# Altium schematic sheet MayRuaMach.SchDoc
size A
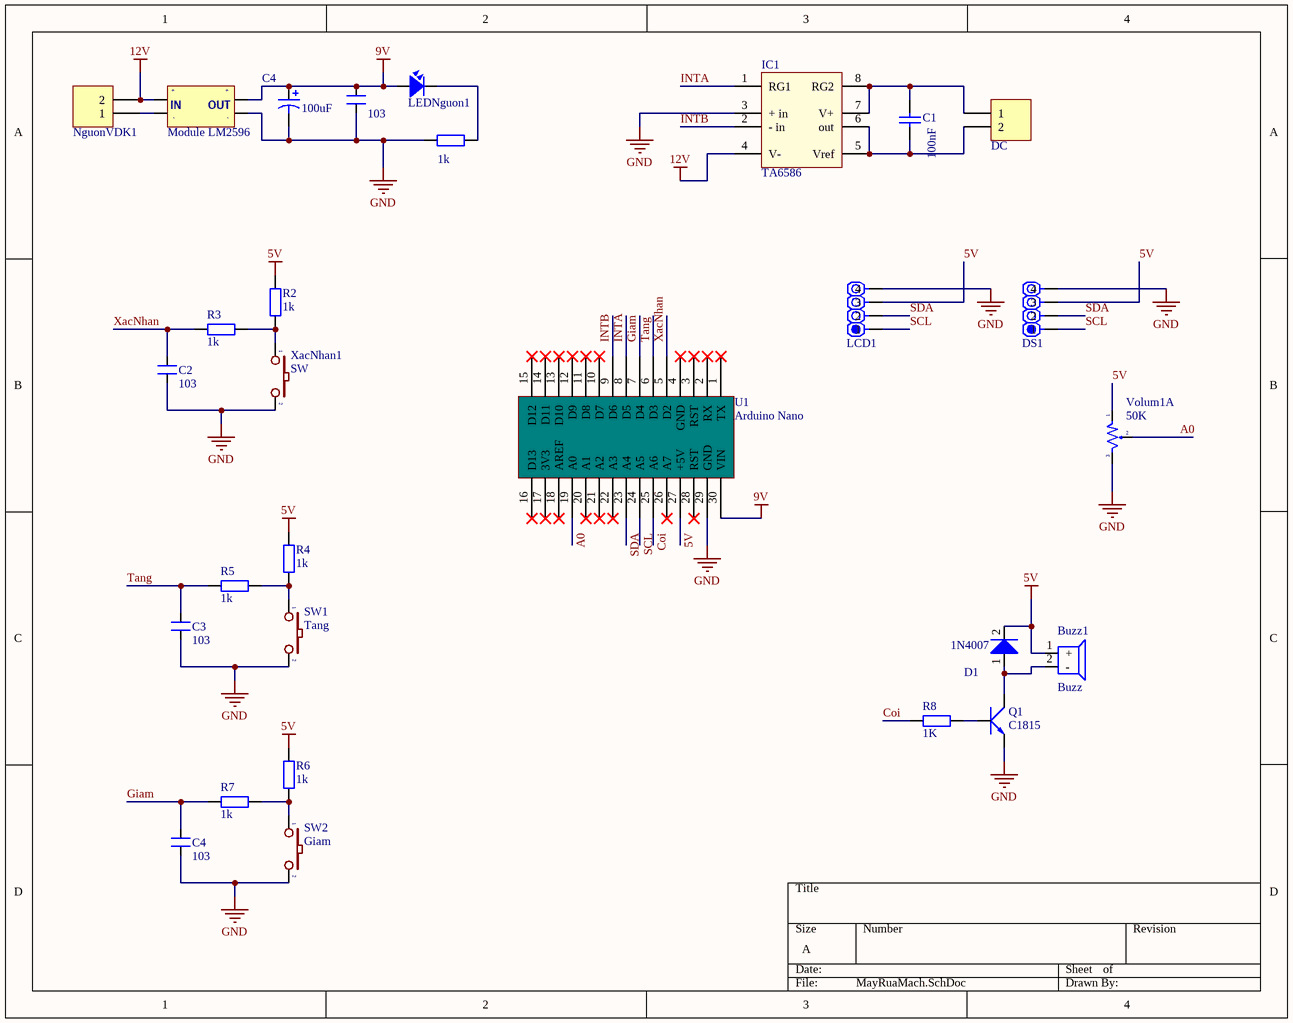
[diagram p0: MayRuaMach.SchDoc]

## Parts
Buzz1  Buzz  [Buzz]
C1  value 100nF  [CAPNTO2.54-3.05x1.78A]  (hidden comment: 5AK220KABAA)
C2  103  [CN1]
C3  103  [CN1]
C4  103  [CN1]
D1  1N4007  [1N4007]
DC  Header 2_1  [HED2]  (value not drawn)
DS1  IO  [CON.HDR1X4L]  (value not drawn)
IC1  TA6586  [DIP8/W0.3]
LCD1  IO  [CON.HDR1X4L]  (value not drawn)
LEDNguon1  LED  [LED-5-RED]  (value not drawn)
M1  Module LM2596  [MODULE LM2596 MINI]
NguonVDK1  Header 2_1  [HED2]  (value not drawn)
Q1  C1815  [QTO-92]
R1  1k  [R1/4W]
R2  1k  [R1/4W]
R3  1k  [R1/4W]
R4  1k  [R1/4W]
R5  1k  [R1/4W]
R6  1k  [R1/4W]
R7  1k  [R1/4W]
R8  1K  [R1/4W]
SW1  Tang  [SW2]
SW2  Giam  [SW2]
TuGom1  103  [CN1]
TuHoa1  100uF  value C4  [CP2/5]
U1  Arduino Nano  [PCBComponent_1]
Volum1  50K  [VOL-D]  (part A of 2)
XacNhan1  SW  [SW2]

## Nets
5V: Buzz1.1(+) D1.2(K) DS1.3 LCD1.3 R2.2 R4.2 R6.2 U1.27(+5V) Volum1.1
9V: LEDNguon1.1 M1.3 TuGom1.2 TuHoa1.1 U1.30(VIN)
12V: IC1.4(V-) M1.1 NguonVDK1.2
GND: C2.1 C3.1 C4.1 DS1.4 IC1.3(+_in) LCD1.4 M1.4 Q1.1(E) R1.1 SW1.2 SW2.2 TuGom1.1 TuHoa1.2 U1.29(GND) Volum1.3 XacNhan1.2
A0: U1.19(A0) Volum1.2
Coi: R8.1 U1.25(A6)
Giam: C4.2 R7.1 U1.7(D4)
INTA: IC1.1(RG1) U1.8(D5)
INTB: IC1.2(-_in) U1.9(D6)
SCL: DS1.1 LCD1.1 U1.24(A5)
SDA: DS1.2 LCD1.2 U1.23(A4)
Tang: C3.2 R5.1 U1.6(D3)
XacNhan: C2.2 R3.1 U1.5(D2)
NetBuzz1_2: Buzz1.2(-) D1.1(A) Q1.2(C)
NetC1_1: C1.1 DC.1 IC1.7(V+) IC1.8(RG2)
NetC1_2: C1.2 DC.2 IC1.5(Vref) IC1.6(out)
NetLEDNguon1_2: LEDNguon1.2 R1.2
NetM1_2: M1.2 NguonVDK1.1
NetQ1_3: Q1.3(B) R8.2
NetR2_1: R2.1 R3.2 XacNhan1.1
NetR4_1: R4.1 R5.2 SW1.1
NetR6_1: R6.1 R7.2 SW2.1

Not connected (* = marked no-connect by the designer): U1 1(TX)* 2(RX)* 3(RST)* 4(GND)* 10(D7)* 11(D8)* 12(D9)* 13(D10)* 14(D11)* 15(D12)* 16(D13)* 17(3V3)* 18(AREF)* 20(A1)* 21(A2)* 22(A3)* 26(A7)* 28(RST)*

## Notes on the sheet
- (in symbol Module LM2596 Mini) +; IN; OUT; -

## Library data of the parts
C1 = 5AK220KABAA: CAP NPO CAPNTO 22pF 100V 10%; ComponentLink1Description: Datasheet; ComponentLink1URL: D:\Dropbox\Datasheets\Passive Components\Capacitors\AVX Disc Ceramic Capacitors.pdf; Unit Price: 0.003
C2-C4 TuGom1 = CN1: Cap np  1pF - 472pF; Value: 100pF
D1 = 1N4007: Diode LS 1A 1000V DO-41; ComponentLink1Description: Datasheet; ComponentLink1URL: D:\Dropbox\Datasheets\Diodes and Rectifiers\Diodes\1N400X.pdf; Unit Price: 0.0072
DC NguonVDK1 = Header 2_1: Header, 2-Pin; Manufacturer: Generic Components; Class: Connector; Value: Header 2
DS1 LCD1 = CON.HDR1x4: Header 1x4; Publisher: NKIM; ComponentLink1Description: Digikey Part link; ComponentLink2Description: Open DataSheet; ComponentLink2URL: H:\LIBRARY\LIBRARY.Datasheet\
IC1 = INA118: Precision, Low Power  INSTRUMENTATION AMPLIFIER; Value: INA118; Designed by: VanDungEvn
LEDNguon1 = LED: LED Single colour Green and Red; Value: LED 3 ly Single Colour
M1 = Module LM2596 Mini
Q1 = C1815: NPN 600mW, ECB; Value: C1815
R1-R8 = R1/4W: Resistor 1/4W; Value: R1/4W - 1K
SW1 SW2 XacNhan1 = SW2: Switch button 2 pin; Value: SW chip 2 pin
TuHoa1 = Cap Pol3: Polarized Capacitor (Surface Mount); 100: 1000pF/35V; LatestRevisionDate: 17-Jul-2002; LatestRevisionNote: Re-released for DXP Platform.; PackageReference: C0805; Publisher: Altium Limited
U1 = Component_1
Volum1 = VOL-D: Volume control Dual; Value: Volume Dual 50K